# EAGLE schematic AB_BOARD_V1 (EAGLE 9.2.1)
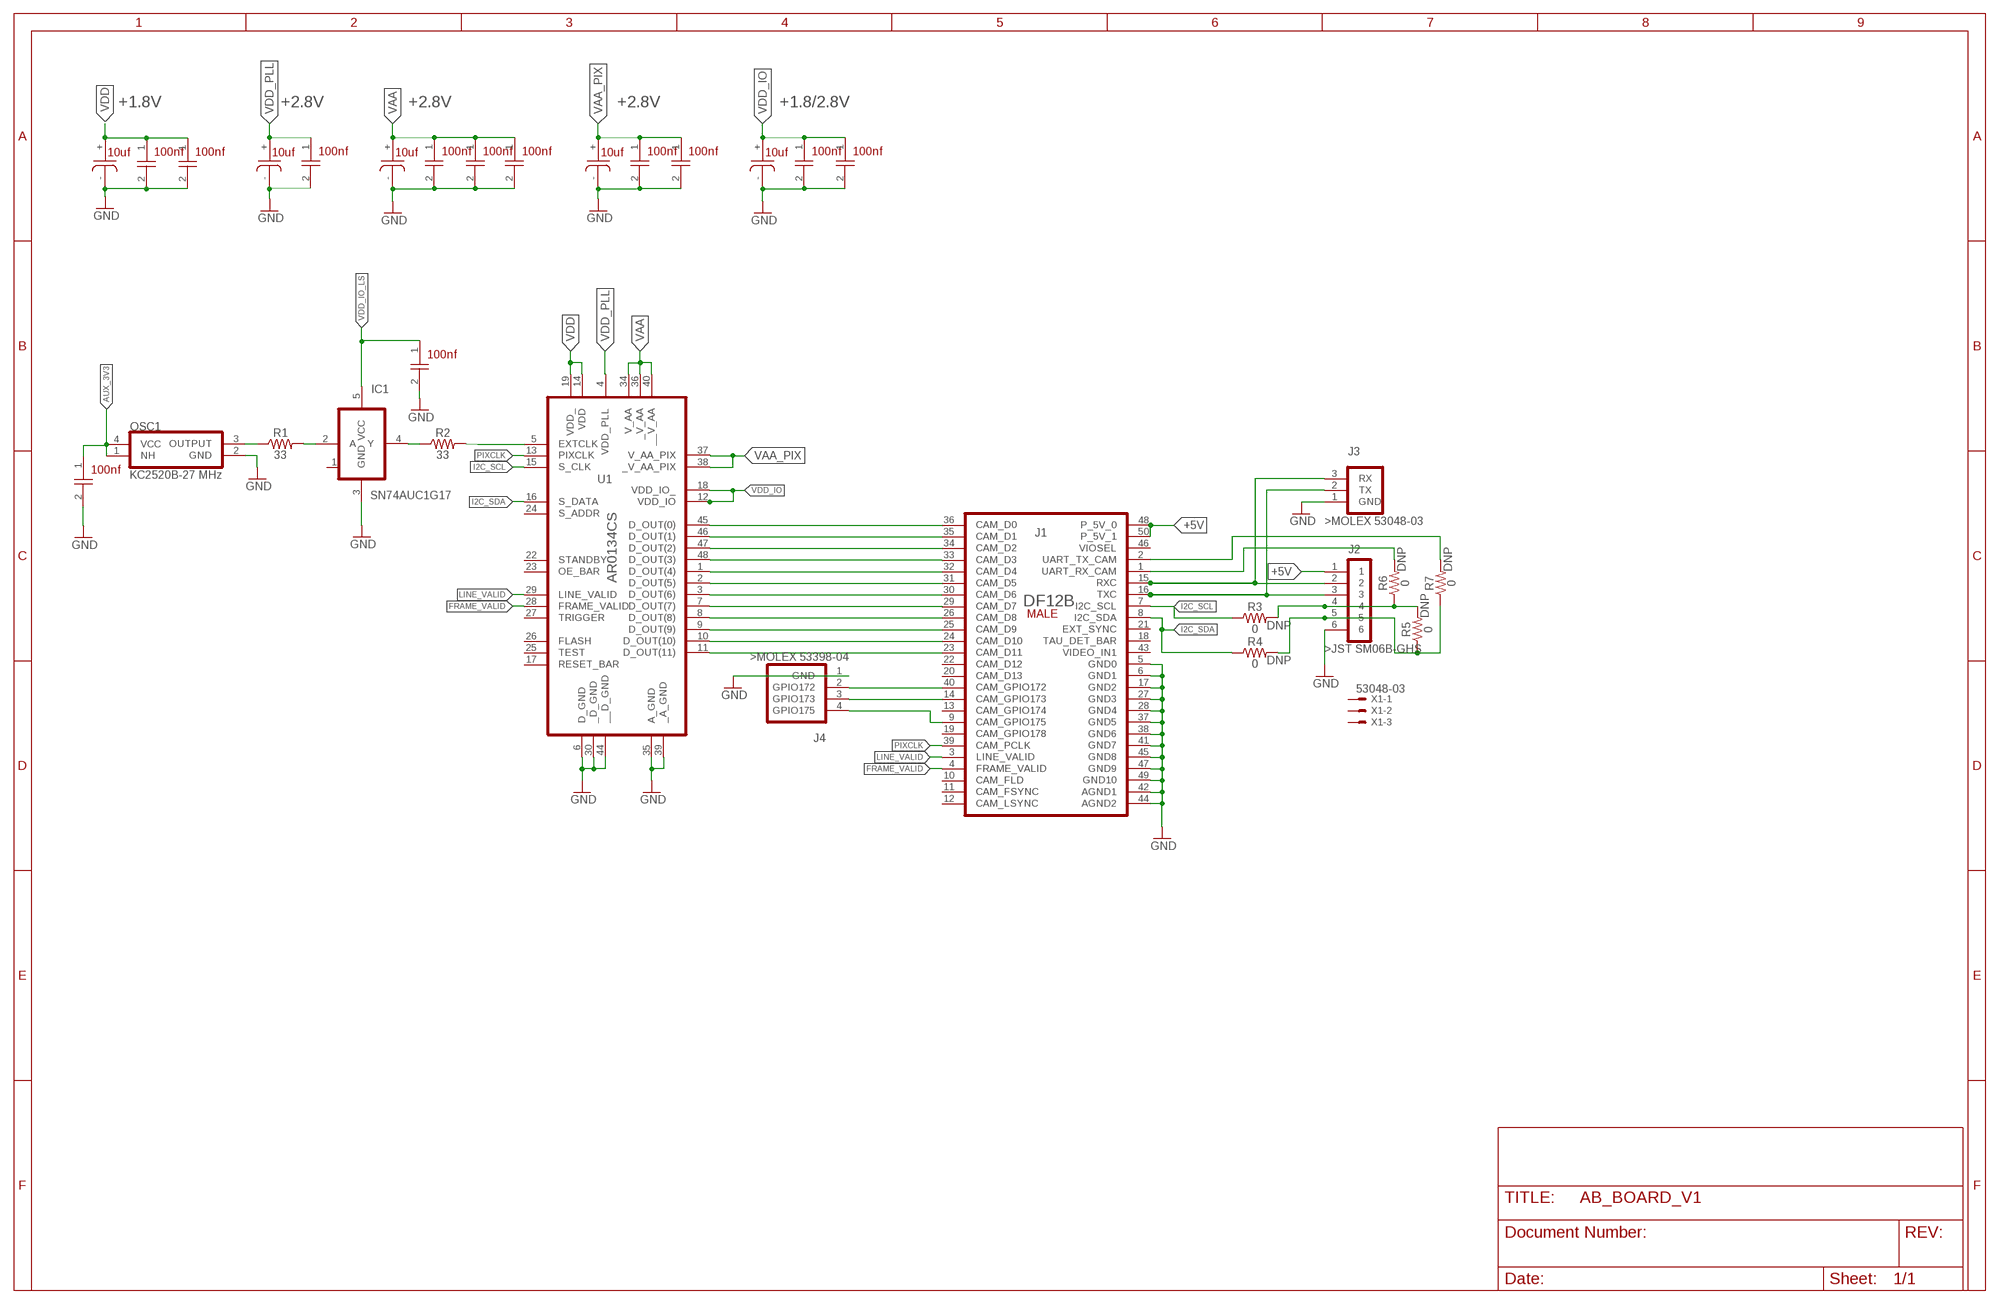
[diagram p0: schematic, sheet 1]

## Parts
C1  10uf  CAP3216-18LOW_ESR  [EIA3216]
C2  10uf  CAP3216-18LOW_ESR  [EIA3216]
C3  10uf  CAP3216-18LOW_ESR  [EIA3216]
C4  10u  CAP3216-18LOW_ESR  [EIA3216]
C5  10uf  CAP3216-18LOW_ESR  [EIA3216]
C6  100nf  CAP0201100NF  [R0201]
C7  100nf  CAP0201100NF  [R0201]
C8  100nf  CAP0201100NF  [R0201]
C9  100nf  CAP0201100NF  [R0201]
C10  100nf  CAP0201100NF  [R0201]
C11  100nf  CAP0201100NF  [R0201]
C12  100nf  CAP0201100NF  [R0201]
C13  100nf  CAP0201100NF  [R0201]
C14  100nf  CAP0201100NF  [R0201]
C15  100nf  CAP0201100NF  [R0201]
C16  100nf  CAP0201100NF  [R0201]
C17  100nf  CAP0201100NF  [R0201]
IC1  SN74AUC1G17  [SOT23-5]
J1  DF12B(5.0)-50DS-0.5(86)SMT  [DF12B(5.0)-50DS-0.5V(86)]
J2  JST_GH_SM06B-GHS-TB  [JST_SM06B-GHS-TB]
J3  MOLEX_53048-03  [53048-03]
J4  MOLEX_53398-04  [53398-04]
OSC1  KC2520B-27MHZ  [2.5X2.0_SMDCRYSTAL]
R1  33  RESISTOR0402  [0402]
R2  33  RESISTOR0402  [0402]
R3  0  RESISTOR0402  [0402]
R4  0  RESISTOR0402  [0402]
R5  0  RESISTOR0402  [0402]
R6  0  RESISTOR0402  [0402]
R7  0  RESISTOR0402  [0402]
U1  AR0134CS-ILCC48  [ILCC48]
X1  53048-03  [53048-03]

## Nets
+5V: J1.48(P_5V_0) J1.50(P_5V_1) J2.1
AUX_3V3: C6.1 OSC1.1(NH) OSC1.4(VCC)
FRAME_VALID: J1.4(FRAME_VALID) U1.28(FRAME_VALID)
GND: C1.- C2.- C3.- C4.- C5.- C6.2 C7.2 C8.2 C9.2 C10.2 C11.2 C12.2 C13.2 C14.2 C15.2 C16.2 C17.2 IC1.3(GND) J1.5(GND0) J1.6(GND1) J1.17(GND2) J1.27(GND3) J1.28(GND4) J1.37(GND5) J1.38(GND6) J1.41(GND7) J1.42(AGND1) J1.44(AGND2) J1.45(GND8) J1.47(GND9) J1.49(GND10) J2.6 J3.1(GND) J4.1(GND) OSC1.2(GND) U1.6(D_GND) U1.30(_D_GND) U1.35(A_GND) U1.39(_A_GND) U1.44(__D_GND)
I2C_SCL: J1.7(I2C_SCL) R3.1 U1.15(S_CLK)
I2C_SDA: J1.8(I2C_SDA) R4.1 U1.16(S_DATA)
LINE_VALID: J1.3(LINE_VALID) U1.29(LINE_VALID)
N$1: J1.36(CAM_D0) U1.45(D_OUT(0))
N$2: J1.35(CAM_D1) U1.46(D_OUT(1))
N$3: J1.34(CAM_D2) U1.47(D_OUT(2))
N$4: J1.33(CAM_D3) U1.48(D_OUT(3))
N$5: J1.32(CAM_D4) U1.1(D_OUT(4))
N$6: J1.31(CAM_D5) U1.2(D_OUT(5))
N$7: J1.30(CAM_D6) U1.3(D_OUT(6))
N$8: J1.29(CAM_D7) U1.7(D_OUT(7))
N$9: J1.26(CAM_D8) U1.8(D_OUT(8))
N$10: J1.25(CAM_D9) U1.9(D_OUT(9))
N$11: J1.24(CAM_D10) U1.10(D_OUT(10))
N$12: J1.23(CAM_D11) U1.11(D_OUT(11))
N$13: IC1.4(Y) R2.1
N$14: R2.2 U1.5(EXTCLK)
N$15: OSC1.3(OUTPUT) R1.1
N$16: IC1.2(A) R1.2
N$17: J1.15(RXC) J2.2 J3.3(RX)
N$18: J1.16(TXC) J2.3 J3.2(TX)
N$19: J2.4 R3.2 R5.2 R6.1
N$20: J2.5 R4.2 R5.1 R7.1
N$21: J1.1(UART_RX_CAM) R6.2
N$22: J1.2(UART_TX_CAM) R7.2
N$23: J1.40(CAM_GPIO172) J4.2(GPIO172)
N$24: J1.14(CAM_GPIO173) J4.3(GPIO173)
N$25: J1.9(CAM_GPIO175) J4.4(GPIO175)
PIXCLK: J1.39(CAM_PCLK) U1.13(PIXCLK)
VAA: C3.+ C11.1 C12.1 C13.1 U1.34(V_AA) U1.36(_V_AA) U1.40(__V_AA)
VAA_PIX: C4.+ C14.1 C15.1 U1.37(V_AA_PIX) U1.38(_V_AA_PIX)
VDD: C1.+ C9.1 C10.1 U1.14(VDD) U1.19(VDD_)
VDD_IO: C5.+ C7.1 C8.1 U1.12(VDD_IO) U1.18(VDD_IO_)
VDD_IO_LS: C17.1 IC1.5(VCC)
VDD_PLL: C2.+ C16.1 U1.4(VDD_PLL)
Unconnected: IC1.1(NC) J1.10(CAM_FLD) J1.11(CAM_FSYNC) J1.12(CAM_LSYNC) J1.13(CAM_GPIO174) J1.18(TAU_DET_BAR) J1.19(CAM_GPIO178) J1.20(CAM_D13) J1.21(EXT_SYNC) J1.22(CAM_D12) J1.43(VIDEO_IN1) J1.46(VIOSEL) U1.17(RESET_BAR) U1.22(STANDBY) U1.23(OE_BAR) U1.24(S_ADDR) U1.25(TEST) U1.26(FLASH) U1.27(TRIGGER) X1.1 X1.2 X1.3

## Notes on the sheet
- +1.8V | +2.8V | +2.8V | +2.8V | +1.8/2.8V
- DNP | DNP
- DNP
- DNP
- DNP

## Library data of the parts
C1-C5 = Sightline:CAP3216-18: TPSA106K016R CAP, TANTALUM CHIP, LOW ESR, 10uF, 10V, 10%, 3216 TPSA106K016R DATASHEET <https://eu.mouser.com/_/N-75hr4?Keyword=TPSA106K016R&FS=True>; DESCRIPTION: CAP, TANTALUM CHIP, LOW ESR, 10uF, 10V, 10%, 3216; MANF: AVX; MANF#: TPSA106K010R0900
C6-C17 = Sightline:CAP0201: CAP0201 PANASONIC CERAMIC CAPACITOR CAP, CERAMIC, 100nF, 10V, X5R, 20%, 0201; DESCRIPTION: CAP, CERAMIC, 100nF, 10V, X5R, 20%, 0201; MANF: PANASONIC; MANF#: ECJZEB1A104M
IC1 = Sightline:SN74AUC1G17: SN74AUC1G17-SOT23-5 IC, BUFFER, SINGLE SCHMITT-TRIGGER, 9mA, 0.8V TO 2.7V, SOT23-5 Specifications Manufacturer: Texas Instruments Manufacturer Part Number: SN74AUC1G17DBVR Supply Voltage: 3.6V Max Body Size(mm): 2.9 x 1.6 SN74AUC1G17 DATASHEET <http://www.ti.com/lit/ds/symlink/sn74auc1g17.pdf> Created by: Kimball S. Davis 24 January 2019 Version 001; DESCRIPTION: IC, BUFFER, SINGLE SCHMITT-TRIGGER, 9mA, 0.8V TO 2.7V, SOT23-5; MANF: TEXAS INSTRUMENTS; MANF#: SN74AUC1G17DBV
J1 = Sightline:DF12B(5.0)-50DS-0.5(86): DF12B(5.0)-50DS-0.5(86) DF12 Series 0.5 mm Pitch SMT Board-to-Board Connector (MALE) Specifications Manufacturer: Hirose Manufacturer Part Number: 537-0309-6 86 Operating Temperature Range(C): -45 - 125 Current Rating: 0.3A Voltage Rating: 50V AC Body Size(mm): 14.6 x 3.6 DF12B(5.0)-50DS DATASHEET <https://www.hirose.com/product/en/products/DF12/> Created by: Kimball S. Davis kimball4@pdx.edu <mailto: kimball4@pdx.edu> 21 January 2019 Version 001; DESCRIPTION: DF12B-50DS-0.5V(86) Hirose Male 50-pin connector; MANF: Hirose; MANF#: 537-0309-6 86
J2 = Sightline:JST_GH_SM06B-GHS-TB: JST SM06B-GHS-TB JST Type GH 1.25mm side-entry smt 6-pin connector Specifications Manufacturer: JST Manufacturer Part Number: SM06B-GHS-TB Body Size(mm): 10.75 X 4.25 JST TYPE GH DATASHEET <http://www.jst-mfg.com/product/pdf/eng/eGH.pdf> Created by: Kimball S. Davis 5 February 2019 Version 001; DESCRIPTION: 1.25 MM SIDE-ENTRY 6-PIN SMT CONNECTOR; MANF: JST; MANF#: SM06B-GHS-TB
J3 = Sightline:MOLEX_53048-03; DESCRIPTION: MOLEX 53048-03 3-PIN CONNECTOR; MANF: MOLEX; MANF#: 53048-0310
J4 = Sightline:MOLEX_53398-04; DESCRIPTION: MOLEX 53398-04 4-PIN SMT CONNECTOR; MANF: MOLEX; MANF#: 53398-0471
OSC1 = Sightline:KC2520B-27MHZ: KC2520B-27MHz-2.5X2.0 27 MHz SMT Clock Oscillator with CMOS output Specifications Manufacturer: Kyocera Manufacturer Part Number: KC2520B27.0000C2GE00 Supply Voltage: 1.8 to 3.3V Body Size(mm): 2.5 x 2.0 KC2520B DATASHEET <https://www.mouser.com/datasheet/2/909/kc2520b_c1_e-1388834.pdf> Created by: Kimball S. Davis 25 January 2019 Version 001; DESCRIPTION: OSC, CRYSTAL CLOCK, SMD, CMOS, 2.25V TO 3.63V, 4mA, 27.0000MHz, 2.5MM x 2.0MM; MANF: Kyocera; MANF#: KC2520B27.0000C2GE00
R1-R7 = SparkFun-Resistors:RESISTOR: Generic Resistor Package
U1 = Sightline:AR0134CS-ILCC48: AR0134CS-1LCC48-10x10 1/3-inch 1.2 Mp CMOS digital image sensor with an active-pixel array of 1280 (H) × 960 (V) Specifications Manufacturer: On Semiconductor Manufacturer Part Number: AR0134CSSM00SPCA0 Operating Temperature Range(C): -30 - 70 Supply Voltage: I/O: 1.8 or 2.8V Digital: 1.8V Analog: 2.8V HiSPi: 0.4V Body Size(mm): 10 x 10 ARO134CS DATASHEET <https://www.onsemi.com/pub/Collateral/AR0134CS-D.PDF> Created by: Kimball S. Davis kimball4@pdx.edu <mailto: kimball4@pdx.edu> 22 January 2019 Version 001; DESCRIPTION: 1/3-inch 1.2 Mp CMOS digital image sensor with an active-pixel array of 1280 (H) × 960 (V); MANF: On Semiconductor; MANF#: AR0134CSSM00SPCA0
X1 = con-molex:53?-03: CONNECTOR wire to board 1.25 mm (.049 inch) pitch header; MF: WALDOM/MOLEX; MPN: 53048-0310; OC_FARNELL: 9732918; OC_NEWARK: 38C9908